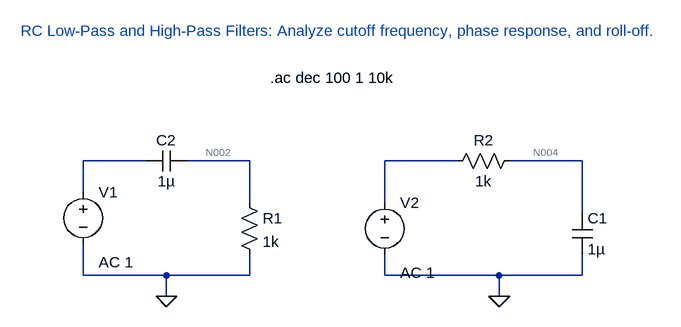
[diagram p0: schematic RC lowpass and highpass.asc]
RC lowpass and highpass.asc, the LTspice schematic file:
Version 4
SHEET 1 928 680
WIRE 64 256 -32 256
WIRE 224 256 128 256
WIRE 544 256 432 256
WIRE 736 256 624 256
WIRE -32 304 -32 256
WIRE 224 320 224 256
WIRE 432 320 432 256
WIRE 736 336 736 256
WIRE -32 432 -32 384
WIRE 96 432 -32 432
WIRE 224 432 224 400
WIRE 224 432 96 432
WIRE 432 432 432 400
WIRE 608 432 432 432
WIRE 736 432 736 400
WIRE 736 432 608 432
WIRE 96 464 96 432
WIRE 608 464 608 432
FLAG 96 464 0
FLAG 608 464 0
SYMBOL voltage -32 288 R0
WINDOW 123 24 124 Left 2
WINDOW 39 0 0 Left 0
SYMATTR InstName V1
SYMATTR Value ""
SYMATTR Value2 AC 1
SYMBOL voltage 432 304 R0
WINDOW 123 24 124 Left 2
WINDOW 39 0 0 Left 0
SYMATTR InstName V2
SYMATTR Value ""
SYMATTR Value2 AC 1
SYMBOL res 208 304 R0
SYMATTR InstName R1
SYMATTR Value 1k
SYMBOL res 640 240 R90
WINDOW 0 0 56 VBottom 2
WINDOW 3 32 56 VTop 2
SYMATTR InstName R2
SYMATTR Value 1k
SYMBOL cap 720 336 R0
SYMATTR InstName C1
SYMATTR Value 1µ
SYMBOL cap 128 240 R90
WINDOW 0 0 32 VBottom 2
WINDOW 3 32 32 VTop 2
SYMATTR InstName C2
SYMATTR Value 1µ
TEXT -128 56 Left 2 ;RC Low-Pass and High-Pass Filters: Analyze cutoff frequency, phase response, and roll-off.
TEXT 256 128 Left 2 !.ac dec 100 1 10k

The netlist it stands for:
* RC lowpass and highpass.asc
V1 N001 0 AC 1
V2 N003 0 AC 1
R1 N002 0 1k
R2 N004 N003 1k
C1 N004 0 1µ
C2 N002 N001 1µ
* RC Low-Pass and High-Pass Filters: Analyze cutoff frequency, phase response, and roll-off.
.ac dec 100 1 10k
.backanno
.end

* Results of the author's LTspice run, read from the files saved beside the schematic
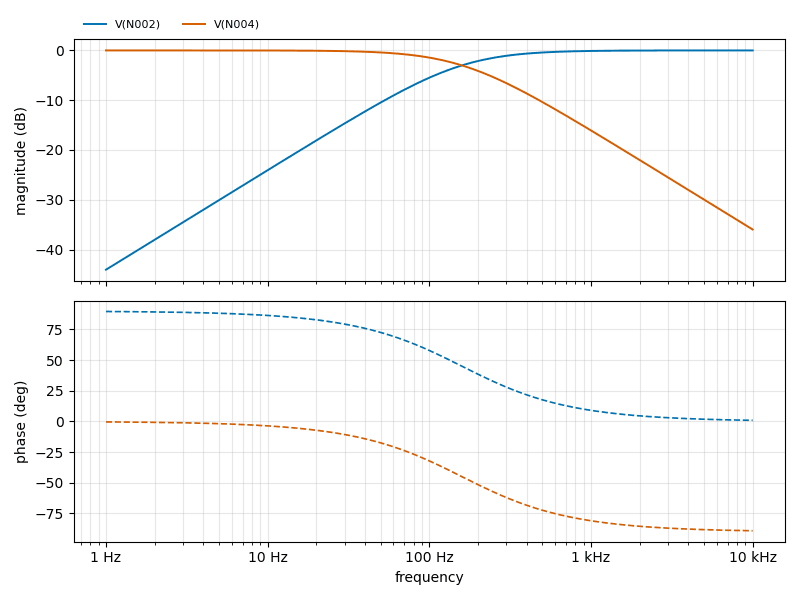
[diagram p1: AC Analysis of RC lowpass and highpass.asc, plotted from the saved traces]
* AC Analysis, 1 run:
*   V(N002): -44.04 dB at 1 Hz, -0.00 dB at 10 kHz, peak -0.00 dB at 10 kHz, 3 dB below the peak at 159.1 Hz
*   V(N004): -0.00 dB at 1 Hz, -35.96 dB at 10 kHz, peak -0.00 dB at 1 Hz, 3 dB below the peak at 159.2 Hz